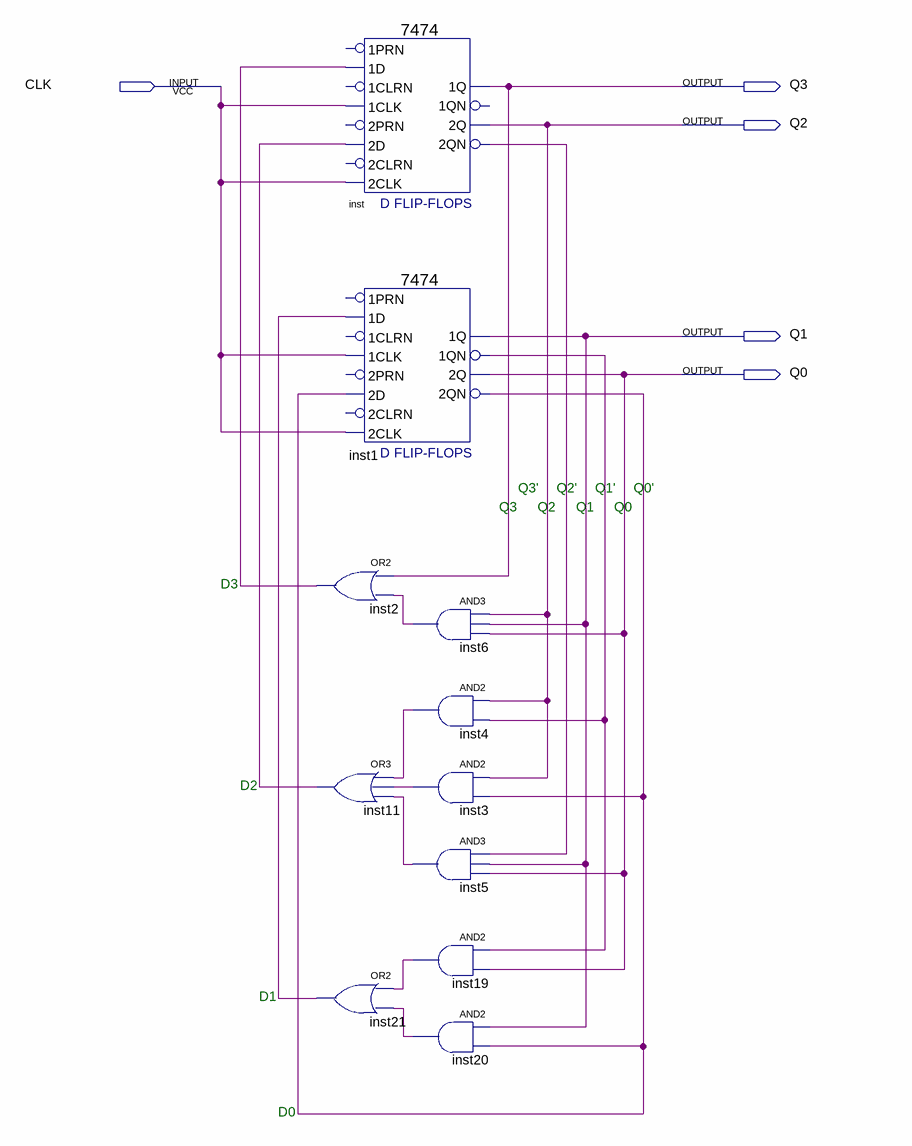
[diagram p0: schematic sheet]
// Quartus schematic Exp04_Cont.bdf as structural Verilog: 11 symbols, 5 pins
module Exp04_Cont (
  input  CLK,
  output Q3,
  output Q2,
  output Q1,
  output Q0
);

  wire inst1_1qn, inst1_2qn, inst2_out, inst3_out, inst4_out, inst5_out, inst6_out, inst11_out, inst19_out,
       inst20_out, inst21_out, inst_2qn;

  or inst2 (inst2_out, Q3, inst6_out);
  or inst11 (inst11_out, inst4_out, inst3_out, inst5_out);
  or inst21 (inst21_out, inst19_out, inst20_out);
  \7474  inst (
    .\2D (inst11_out), .\1CLK (CLK), .\1D (inst2_out), .\2CLK (CLK), .\2Q (Q2), .\2QN (inst_2qn), .\1Q (Q3));  // open: 2PRN, 1PRN, 2CLRN, 1CLRN, 1QN
  \7474  inst1 (
    .\2D (inst1_2qn), .\1CLK (CLK), .\1D (inst21_out), .\2CLK (CLK), .\1QN (inst1_1qn), .\2Q (Q0),
    .\2QN (inst1_2qn), .\1Q (Q1));  // open: 2PRN, 1PRN, 2CLRN, 1CLRN
  and inst6 (inst6_out, Q2, Q1, Q0);
  and inst4 (inst4_out, Q2, inst1_1qn);
  and inst3 (inst3_out, Q2, inst1_2qn);
  and inst5 (inst5_out, inst_2qn, Q1, Q0);
  and inst19 (inst19_out, inst1_1qn, Q0);
  and inst20 (inst20_out, Q1, inst1_2qn);

  // Notes on the sheet:
  //   Q3'
  //   Q2'
  //   Q1'
  //   Q0'
  //   Q3
  //   Q2
  //   Q1
  //   Q0
  //   D3
  //   D2
  //   D1
  //   D0
endmodule
